# Altium project PCB_INTER_V1.2.PrjPcb
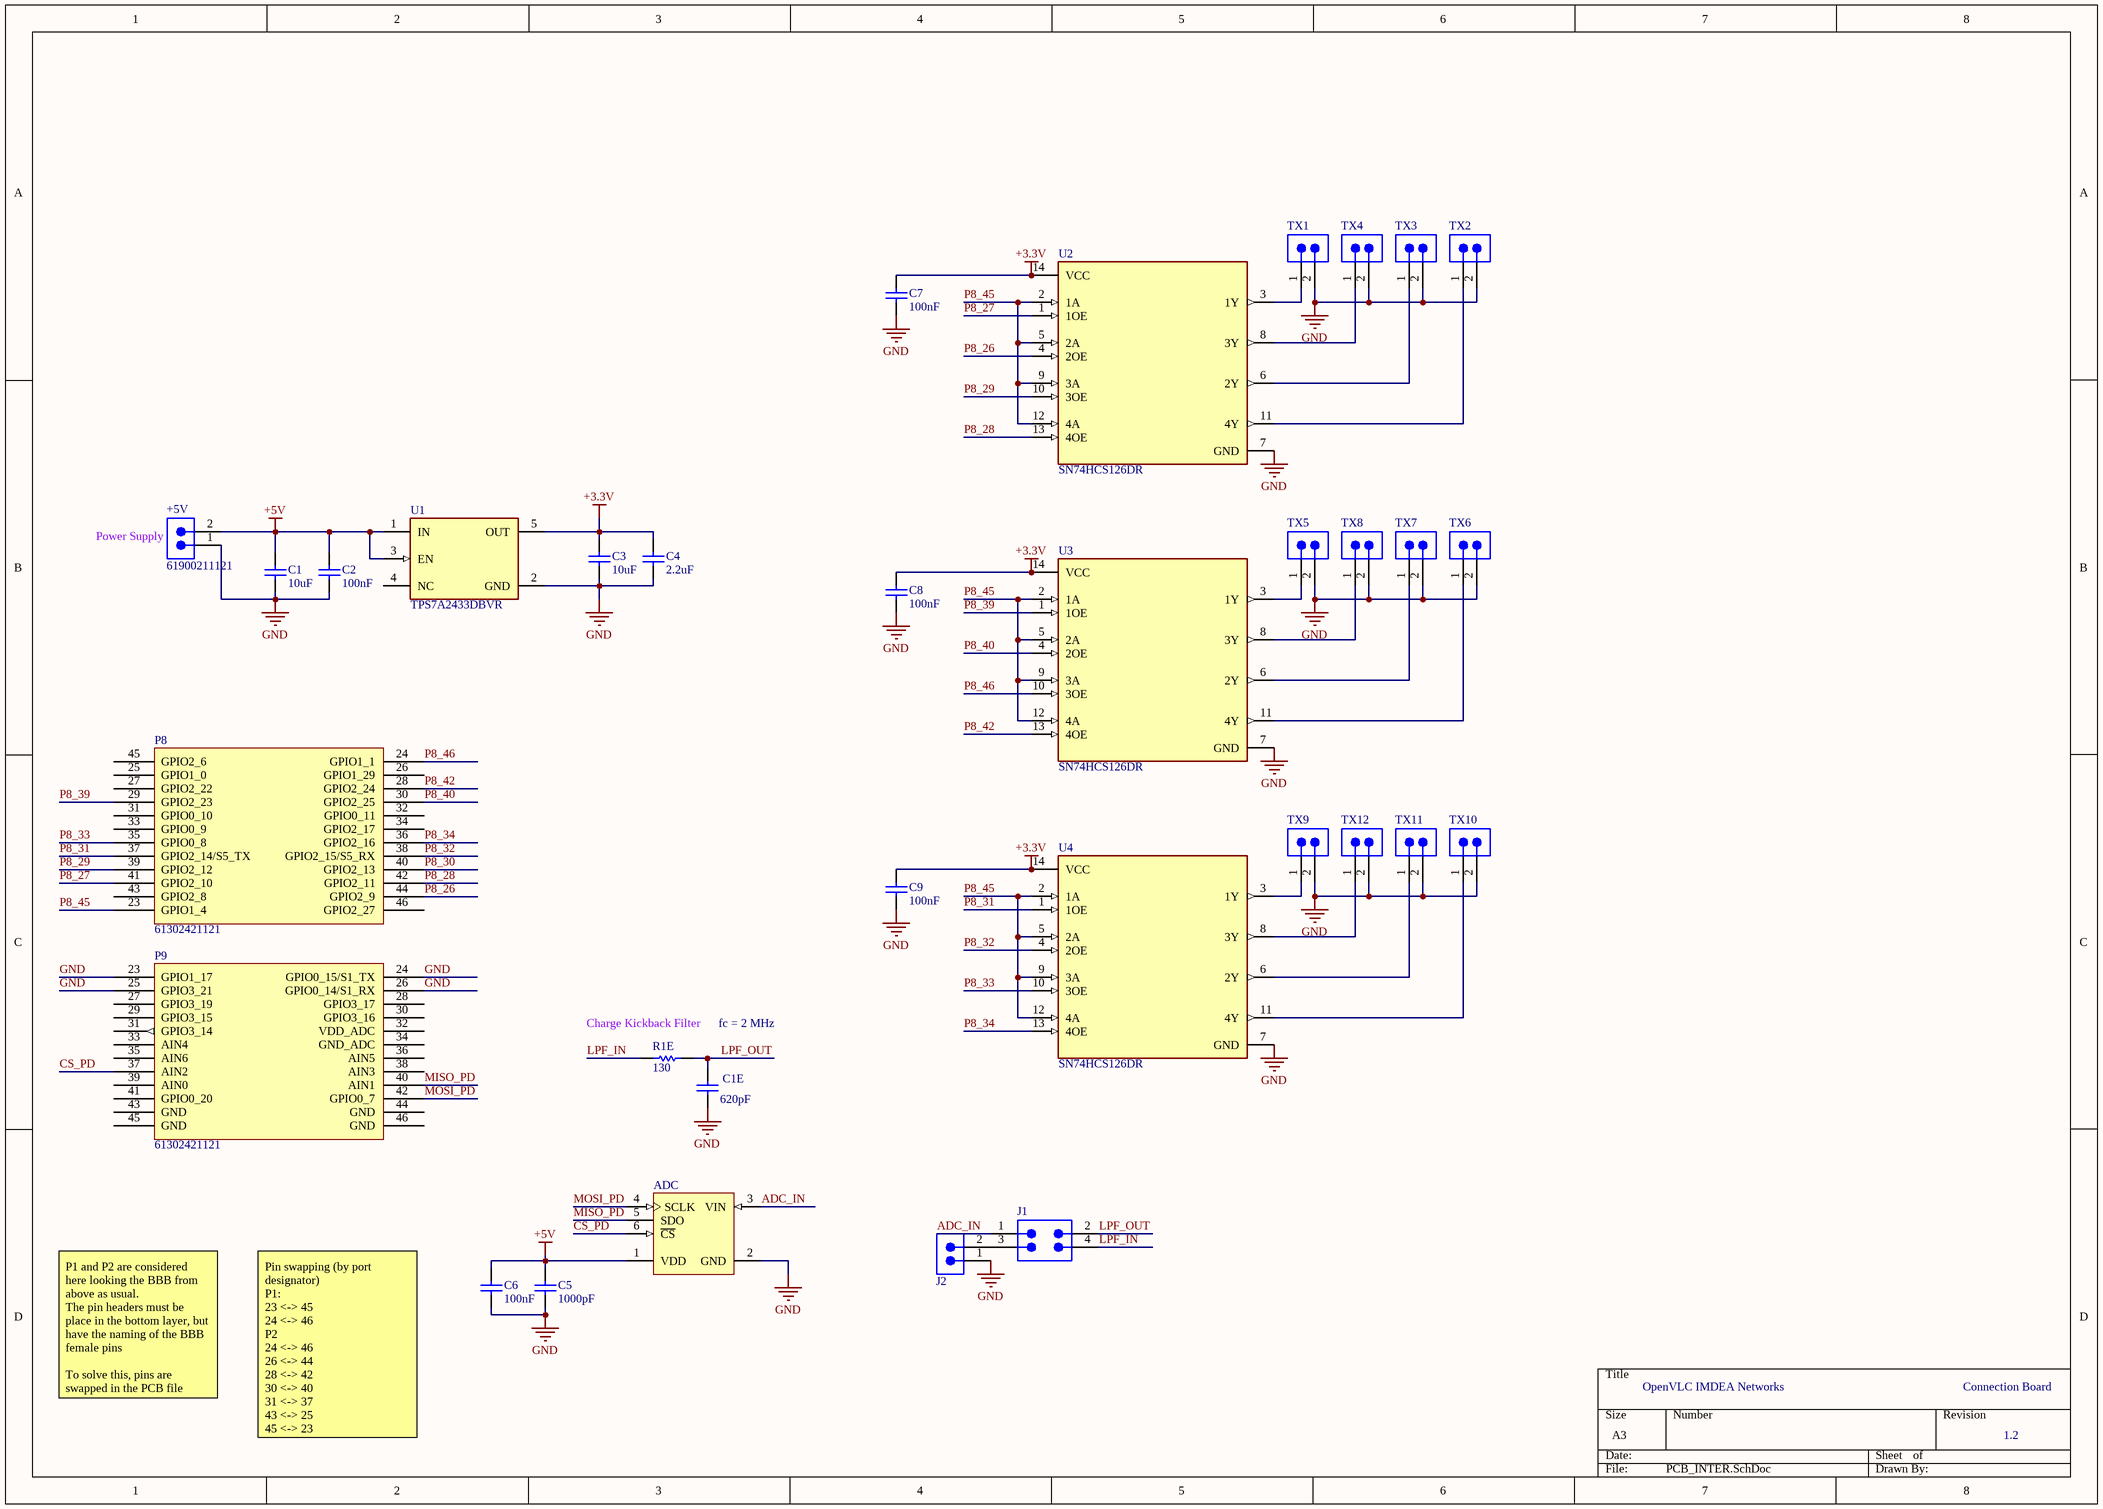
[diagram p0: PCB_INTER.SchDoc]
1 sheet, 33 parts. Net scope: global (net labels, ports and power ports of the same name join across sheets).
Board file: PCB_INTER.PcbDoc

## Sheet PCB_INTER.SchDoc
size A3; SheetNumber: 1; SheetTotal: 1

### Parts
+5V  61900211121  [61900211121]
ADC  ADS7886SBDBVR  [TI-DBV6_M]  (value not drawn)
C1  value 10uF  [RESC1608X55N]  (hidden comment: GRM188R6YA106MA73D)
C1E  value 620pF  [RESC1608X55N]  (hidden comment: Cap)
C2  value 100nF  [RESC1608X55N]  (hidden comment: GCM188R71H104KA57J)
C3  value 10uF  [RESC1608X55N]  (hidden comment: GRM188R6YA106MA73D)
C4  value 2.2uF  [RESC1608X55N]  (hidden comment: GCM188R71H104KA57J)
C5  value 1000pF  [RESC1608X55N]  (hidden comment: Cap)
C6  value 100nF  [RESC1608X55N]  (hidden comment: Cap)
C7  value 100nF  [RESC1608X55N]  (hidden comment: GCM188R71H104KA57J)
C8  value 100nF  [RESC1608X55N]  (hidden comment: GCM188R71H104KA57J)
C9  value 100nF  [RESC1608X55N]  (hidden comment: GCM188R71H104KA57J)
J1  61300421121  [61300421121]  (value not drawn)
J2  61900211121  [61900211121]  (value not drawn)
P8  61302421121  [BBB_CAPE_NO_HEADER_R_24]
P9  61302421121  [BBB_CAPE_NO_HEADER_R_24]
R1E  value 130  [RESC1608X55N]  (hidden comment: Res1)
TX1  61900211121  [61900211121]  (value not drawn)
TX2  61900211121  [61900211121]  (value not drawn)
TX3  61900211121  [61900211121]  (value not drawn)
TX4  61900211121  [61900211121]  (value not drawn)
TX5  61900211121  [61900211121]  (value not drawn)
TX6  61900211121  [61900211121]  (value not drawn)
TX7  61900211121  [61900211121]  (value not drawn)
TX8  61900211121  [61900211121]  (value not drawn)
TX9  61900211121  [61900211121]  (value not drawn)
TX10  61900211121  [61900211121]  (value not drawn)
TX11  61900211121  [61900211121]  (value not drawn)
TX12  61900211121  [61900211121]  (value not drawn)
U1  TPS7A2433DBVR  [FP-DBV0005A-MFG]
U2  SN74HCS126DR  [FP-D0014A-IPC_A]
U3  SN74HCS126DR  [FP-D0014A-IPC_A]
U4  SN74HCS126DR  [FP-D0014A-IPC_A]

### Nets
+3.3V: C3.2 C4.1 C7.1 C8.1 C9.1 U1.5(OUT) U2.14(VCC) U3.14(VCC) U4.14(VCC)
+5V: +5V.2 ADC.1(VDD) C1.1 C2.1 C5.1 C6.1 U1.1(IN) U1.3(EN)
GND: +5V.1 ADC.2(GND) C1.2 C1E.2 C2.2 C3.1 C4.2 C5.2 C6.2 C7.2 C8.2 C9.2 J2.1 P9.23(GPIO1_17) P9.24(GPIO0_15/S1_TX) P9.25(GPIO3_21) P9.26(GPIO0_14/S1_RX) TX1.2 TX2.2 TX3.2 TX4.2 TX5.2 TX6.2 TX7.2 TX8.2 TX9.2 TX10.2 TX11.2 TX12.2 U1.2(GND) U2.7(GND) U3.7(GND) U4.7(GND)
ADC_IN: ADC.3(VIN) J1.1
CS_PD: ADC.6(~{CS}) P9.37(AIN2)
LPF_IN: J1.4 R1E.2
LPF_OUT: C1E.1 J1.2 R1E.1
MISO_PD: ADC.5(SDO) P9.40(AIN1)
MOSI_PD: ADC.4(SCLK) P9.42(GPIO0_7)
P8_26: P8.44(GPIO2_9) U2.4(2OE)
P8_27: P8.41(GPIO2_10) U2.1(1OE)
P8_28: P8.42(GPIO2_11) U2.13(4OE)
P8_29: P8.39(GPIO2_12) U2.10(3OE)
P8_30: P8.40(GPIO2_13)
P8_31: P8.37(GPIO2_14/S5_TX) U4.1(1OE)
P8_32: P8.38(GPIO2_15/S5_RX) U4.4(2OE)
P8_33: P8.35(GPIO0_8) U4.10(3OE)
P8_34: P8.36(GPIO2_16) U4.13(4OE)
P8_39: P8.29(GPIO2_23) U3.1(1OE)
P8_40: P8.30(GPIO2_25) U3.4(2OE)
P8_42: P8.28(GPIO2_24) U3.13(4OE)
P8_45: P8.23(GPIO1_4) U2.2(1A) U2.5(2A) U2.9(3A) U2.12(4A) U3.2(1A) U3.5(2A) U3.9(3A) U3.12(4A) U4.2(1A) U4.5(2A) U4.9(3A) U4.12(4A)
P8_46: P8.24(GPIO1_1) U3.10(3OE)
NetJ1_3: J1.3 J2.2
NetTX1_1: TX1.1 U2.3(1Y)
NetTX2_1: TX2.1 U2.11(4Y)
NetTX3_1: TX3.1 U2.6(2Y)
NetTX4_1: TX4.1 U2.8(3Y)
NetTX5_1: TX5.1 U3.3(1Y)
NetTX6_1: TX6.1 U3.11(4Y)
NetTX7_1: TX7.1 U3.6(2Y)
NetTX8_1: TX8.1 U3.8(3Y)
NetTX9_1: TX9.1 U4.3(1Y)
NetTX10_1: TX10.1 U4.11(4Y)
NetTX11_1: TX11.1 U4.6(2Y)
NetTX12_1: TX12.1 U4.8(3Y)

Not connected (* = marked no-connect by the designer): P8 25(GPIO1_0) 26(GPIO1_29) 27(GPIO2_22) 31(GPIO0_10) 32(GPIO0_11) 33(GPIO0_9) 34(GPIO2_17) 43(GPIO2_8) 45(GPIO2_6) 46(GPIO2_27); P9 27(GPIO3_19) 28(GPIO3_17) 29(GPIO3_15) 30(GPIO3_16) 31(GPIO3_14) 32(VDD_ADC) 33(AIN4) 34(GND_ADC) 35(AIN6) 36(AIN5) 38(AIN3) 39(AIN0) 41(GPIO0_20) 43(GND) 44(GND) 45(GND) 46(GND); U1 4(NC)

### Notes on the sheet
- (near +5V) Power Supply
- (near R1E) Charge Kickback Filter
- fc = 2 MHz
- P1 and P2 are considered here looking the BBB from above as usual.
  The pin headers must be place in the bottom layer, but have the naming of the BBB female pins
  To solve this, pins are swapped in the PCB file
- OpenVLC IMDEA Networks
- Connection Board
- Pin swapping (by port designator)
  P1:
  23 <-> 45
  24 <-> 46
  P2
  24 <-> 46
  26 <-> 44
  28 <-> 42
  30 <-> 40
  31 <-> 37
  43 <-> 25
  45 <-> 23
- 1.2

### Library data of the parts
+5V J2 TX1-TX12 = CMP-1502-00584-3: NexarPartId: 18818218; Gender: Male; Connector Type: Male Pin; Insulation Resistance: 1GΩ; Contact Resistance: 20mΩ; Number of Contacts: 2; Operating Supply Voltage: 250V; Current Rating: 3A; Pitch: 2.54mm; Color: Beige; Fastening Type: Friction; Number of Pins: 2; Lead Pitch: 2.54mm; Orientation: Vertical; Max Operating Temperature: 105°C; Contact Mating Length: 7.493mm; RoHS: Compliant; Voltage Rating: 250V; Number of Positions: 2; Mount: Through Hole; Length: 5.08mm; Contact Plating: Tin; Width: 5.12mm; Termination: Through Hole; Flammability Rating: UL94 V-0; Min Operating Temperature: -40°C; Housing Material: Nylon; Contact Gender: Male; Number of Rows: 1; Packaging: Bulk; REACH SVHC: Unknown; Contact Material: Copper; Height: 11.75mm
ADC = CMP-0003-00246-2: 2.35 to 5.25 V, 12-Bit, 1 MSPS, Serial ADC, -40 to 125 degC, 6-pin SOT23 (DBV6), Green (RoHS & no Sb/Br); Manufacturer: Texas Instruments; Sample Rate (max)(SPS): 1M; INL(Max)(+/-LSB): 1.25; Digital Supply(Min)(V): 2.35; SNR(dB): 71.25; Interface: Serial SPI; Resolution(Bits): 12; SubFamily: Precision ADC (<=10MSPS); # Input Channels: 1; Digital Supply(Max)(V): 5.25; SFDR(dB): 85.5; Architecture: SAR; PackageDescription: 6-Pin Plastic Small Outline, Body 1.6 x 2.9 mm, Pitch 0.95 mm; ComponentLink1URL: http://www.ti.com/; PackageReference: DBV6; PartNumber: ADS7886SBDBVR; ComponentLink1Description: Manufacturer URL; ComponentLink2Description: Datasheet; Code_JEDEC: MO-178; ComponentLink3URL: http://www.ti.com/litv/pdf/mpds026h; ComponentLink2URL: http://www.ti.com/general/docs/lit/getliterature.tsp?genericPartNumber=ADS7886&fileType=pdf; ComponentLink3Description: Package Specification; Eco-Plan: Green (RoHS & no Sb/Br); Analog Voltage AV/DD(Min)(V): 2.35; DatasheetVersion: SLAS492A; SINAD(dB): 71.25; Mounting Technology: Surface Mount; PackageVersion: 4073253-5/K, 03/2006; Analog Voltage AV/DD(Max)(V): 5.25
C1 C1E C2-C9 = Cap: Capacitor; Published: 8-Jun-2000; LatestRevisionDate: 17-Jul-2002; LatestRevisionNote: Re-released for DXP Platform.; PackageReference: RAD-0.3; Publisher: Altium Limited; PackageDescription: Radial Cap, Thru-Hole; 2 Leads; 0.3 in Pin Spacing
J1 = CMP-1502-01066-4: NexarPartId: 32855524; Number of Positions: 4; Operating Supply Voltage: 250V; Pitch: 2.54mm; Connector Type: Male Pin; Current Rating: 3A; Contact Resistance: 20mΩ; Gender: Male; Number of Pins: 4; Max Operating Temperature: 105°C; Number of Contacts: 4; Contact Mating Length: 5.9944mm; Min Operating Temperature: -40°C; Orientation: Vertical; Height: 8.89mm; Mount: Through Hole; Lead Pitch: 2.54mm; Contact Material: Copper; Color: Black; Voltage Rating: 250V; RoHS: Compliant; Termination: Solder; Row Spacing: 2.54mm; Contact Plating: Gold; Number of Rows: 2; Lead Free: Lead Free; REACH SVHC: Unknown; Packaging: Bulk
P8 = BBB_P8_reduced
P9 = BBB_P9_reduced
R1E = Res1: Resistor; Published: 8-Jun-2000; LatestRevisionDate: 17-Jul-2002; LatestRevisionNote: Re-released for DXP Platform.; PackageReference: AXIAL-0.3; Publisher: Altium Limited; PackageDescription: Axial Device, Thru-Hole; 2 Leads; 0.3 in Pin Spacing
U1 = CMP-00370-106221451-1: TPS7A2433DBVR 200-mA, 18-V, ultra-low-IQ, low-dropout (LDO) voltage regulator with enable ; 5-SOT-23 -40 to 125; Manufacturer Lifecycle Status: ACTIVE; Number of Channels: 1; Output Voltage: 3.3V; Number of Pins: 5; NexarPartId: 106221451; Lifecycle Status: Production; Thickness: 1.2mm; Length: 2.9mm; Height: 1.45mm; Case/Package: SOT-23; Width: 1.6mm
U2-U4 = CMP-04900-000037-1: Schmitt-trigger inputs quadruple bus buffer gates with 3-state outputs 14-SOIC -40 to 125